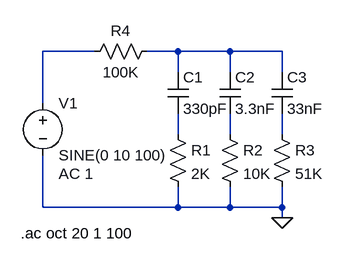
[diagram p0: schematic Moritz_Pink_Noise_LTSpice.asc]
Moritz_Pink_Noise_LTSpice.asc, the LTspice schematic file:
Version 4
SHEET 1 880 680
WIRE 96 48 16 48
WIRE 224 48 176 48
WIRE 304 48 224 48
WIRE 384 48 304 48
WIRE 224 80 224 48
WIRE 304 80 304 48
WIRE 384 80 384 48
WIRE 16 128 16 48
WIRE 224 176 224 144
WIRE 304 176 304 144
WIRE 384 176 384 144
WIRE 16 288 16 208
WIRE 224 288 224 256
WIRE 224 288 16 288
WIRE 304 288 304 256
WIRE 304 288 224 288
WIRE 384 288 384 256
WIRE 384 288 304 288
WIRE 384 304 384 288
FLAG 384 304 0
SYMBOL res 208 160 R0
SYMATTR InstName R1
SYMATTR Value 2K
SYMBOL res 288 160 R0
SYMATTR InstName R2
SYMATTR Value 10K
SYMBOL res 368 160 R0
SYMATTR InstName R3
SYMATTR Value 51K
SYMBOL cap 208 80 R0
SYMATTR InstName C1
SYMATTR Value 330pF
SYMBOL cap 288 80 R0
SYMATTR InstName C2
SYMATTR Value 3.3nF
SYMBOL cap 368 80 R0
SYMATTR InstName C3
SYMATTR Value 33nF
SYMBOL res 192 32 R90
WINDOW 0 0 56 VBottom 2
WINDOW 3 32 56 VTop 2
SYMATTR InstName R4
SYMATTR Value 100K
SYMBOL voltage 16 112 R0
WINDOW 123 24 124 Left 2
WINDOW 39 0 0 Left 0
SYMATTR InstName V1
SYMATTR Value SINE(0 10 100)
SYMATTR Value2 AC 1
TEXT -18 328 Left 2 !.ac oct 20 1 100

The netlist it stands for:
* Moritz_Pink_Noise_LTSpice.asc
R1 N003 0 2K
R2 N004 0 10K
R3 N005 0 51K
C1 N002 N003 330pF
C2 N002 N004 3.3nF
C3 N002 N005 33nF
R4 N002 N001 100K
V1 N001 0 SINE(0 10 100) AC 1
.ac oct 20 1 100
.backanno
.end